# EAGLE design mojo_test_esc (EAGLE 7.6.0)
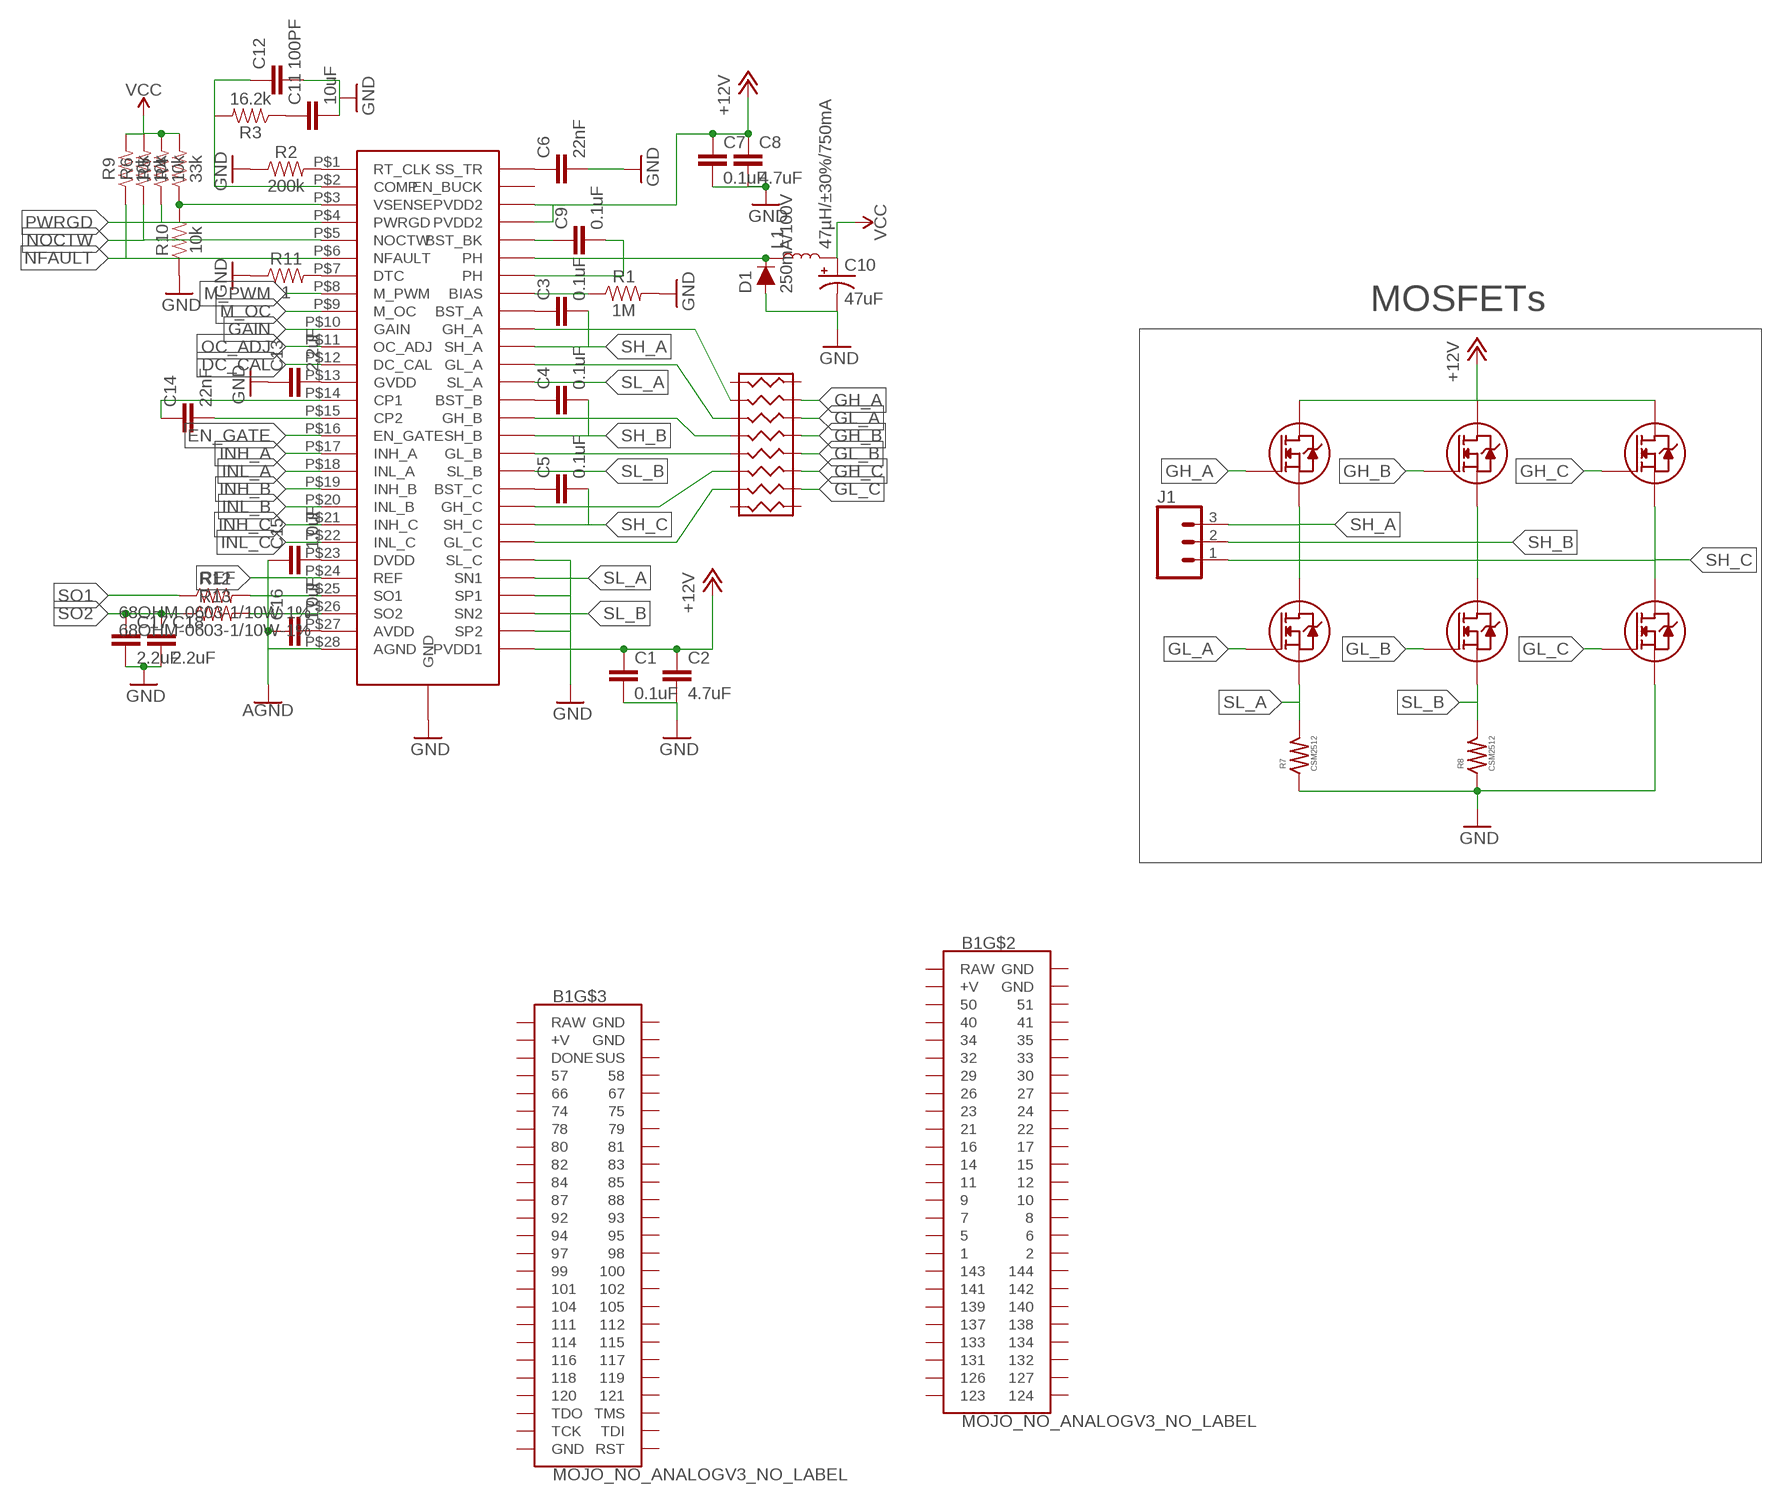
[diagram p0: schematic, sheet 1]

## Parts
B1  MOJO_NO_ANALOGV3_NO_LABEL  [MOJO_V3_NO_LABEL_NO_ANALOG]
C1  0.1uF  0.1UF-0402-16V-10%  [0402]
C2  4.7uF  4.7UF0603  [0603]
C3  0.1uF  0.1UF-0402-16V-10%  [0402]
C4  0.1uF  0.1UF-0402-16V-10%  [0402]
C5  0.1uF  0.1UF-0402-16V-10%  [0402]
C6  22nF  22NF/22,000PF-0603-50V-10%  [0603]
C7  0.1uF  0.1UF-0402-16V-10%  [0402]
C8  4.7uF  4.7UF0603  [0603]
C9  0.1uF  0.1UF-0402-16V-10%  [0402]
C10  47uF  47UF-POLAR-EIA3528-10V-10%  [EIA3528]
C11  10uF  10UF-0603-6.3V-20%  [0603]
C12  100PF  100PF-0402-50V-5%  [0402]
C13  2.2uF  2.2UF-0603-10V-20%  [0603]
C14  22nF  22NF/22,000PF-0603-50V-10%  [0603]
C15  1.0uF  1.0UF-0402-16V-10%  [0402]
C16  1.0uF  1.0UF-0402-16V-10%  [0402]
C17  2.2uF  2.2UF-0603-10V-20%  [0603]
C18  2.2uF  2.2UF-0603-10V-20%  [0603]
D1  250mA/100V  DIODE-BAS16J  [SOD-323]
J1  CONN_03-SCREW-5MM  [SCREWTERMINAL-5MM-3]
L1  47µH/±30%/750mA  INDUCTOR-CR54-47UH  [CR54]
MOSFET_H_A_1  MOSFET  [SOP_ADVANCE]
MOSFET_H_B_1  MOSFET  [SOP_ADVANCE]
MOSFET_H_C_1  MOSFET  [SOP_ADVANCE]
MOSFET_L_A_1  MOSFET  [SOP_ADVANCE]
MOSFET_L_B_1  MOSFET  [SOP_ADVANCE]
MOSFET_L_C_1  MOSFET  [SOP_ADVANCE]
R1  1M  1MOHM-0603-1/4W-5%  [0603]
R2  200k  200KOHM-0603-1/10W-1%  [0603]
R3  16.2k  16.2KOHM-0603-1/10W-1%  [0603]
R4  33k  33KOHM-0603-1/10W-1%  [0603]
R5  10k  10KOHM-0603-1/10W-1%  [0603]
R6  10k  10KOHM-0603-1/10W-1%  [0603]
R7  CSM2512  [CSM2512]
R8  CSM2512  [CSM2512]
R9  10k  10KOHM-0603-1/10W-1%  [0603]
R10  10k  10KOHM-0603-1/10W-1%  [0603]
R11  1  1OHM-0603-1/10W-1%  [0603]
R12  68OHM-0603-1/10W-1%  [0603]
R13  68OHM-0603-1/10W-1%  [0603]
U$1  DRV8302  [DRV8302]
U$2  EXB2HV  [EXB2HV]

## Nets
+12V: C1.1 C2.1 C7.1 C8.1 MOSFET_H_A_1.P$5(D2) MOSFET_H_A_1.P$6(D2) MOSFET_H_A_1.P$7(D2) MOSFET_H_A_1.P$8(D2) MOSFET_H_A_1.P$9(D2) MOSFET_H_B_1.P$5(D2) MOSFET_H_B_1.P$6(D2) MOSFET_H_B_1.P$7(D2) MOSFET_H_B_1.P$8(D2) MOSFET_H_B_1.P$9(D2) MOSFET_H_C_1.P$5(D2) MOSFET_H_C_1.P$6(D2) MOSFET_H_C_1.P$7(D2) MOSFET_H_C_1.P$8(D2) MOSFET_H_C_1.P$9(D2) U$1.P$29(PVDD1) U$1.P$53(PVDD2) U$1.P$54(PVDD2)
AGND: C15.1 C16.1 U$1.P$28(AGND)
DC_CAL: U$1.P$12(DC_CAL)
EN_GATE: U$1.P$16(EN_GATE)
GAIN: U$1.P$10(GAIN)
GH_A: MOSFET_H_A_1.P$4(G1)
GH_B: MOSFET_H_B_1.P$4(G1)
GH_C: MOSFET_H_C_1.P$4(G1)
GL_A: MOSFET_L_A_1.P$4(G1)
GL_A_BEF_RES: U$1.P$45(GL_A) U$2.P3B
GL_B: MOSFET_L_B_1.P$4(G1)
GL_C: MOSFET_L_C_1.P$4(G1)
GND: C1.2 C2.2 C6.2 C7.2 C8.2 C10.C(-) C11.2 C12.2 C13.1 C17.2 C18.2 D1.A MOSFET_L_C_1.P$1(S3) MOSFET_L_C_1.P$2(S3) MOSFET_L_C_1.P$3(S3) R1.2 R2.1 R7.P1L R7.P2L R8.P1L R8.P2L R10.1 R11.1 U$1.GND_PAD2(GND) U$1.GND_PAD3(GND) U$1.GND_PAD(GND) U$1.P$30(SP2) U$1.P$32(SP1) U$1.P$34(SL_C) U$1.VIA1(GND) U$1.VIA2(GND) U$1.VIA3(GND) U$1.VIA4(GND) U$1.VIA5(GND) U$1.VIA6(GND) U$1.VIA7(GND) U$1.VIA8(GND) U$1.VIA9(GND) U$1.VIA10(GND) U$1.VIA11(GND) U$1.VIA12(GND) U$1.VIA13(GND) U$1.VIA14(GND) U$1.VIA15(GND) U$1.VIA16(GND) U$1.VIA17(GND) U$1.VIA18(GND) U$1.VIA19(GND) U$1.VIA20(GND) U$1.VIA21(GND) U$1.VIA22(GND) U$1.VIA23(GND) U$1.VIA24(GND) U$1.VIA25(GND) U$1.VIA26(GND) U$1.VIA27(GND) U$1.VIA28(GND) U$1.VIA29(GND) U$1.VIA30(GND) U$1.VIA31(GND) U$1.VIA32(GND) U$1.VIA33(GND) U$1.VIA34(GND) U$1.VIA35(GND) U$1.VIA36(GND) U$1.VIA37(GND) U$1.VIA38(GND) U$1.VIA39(GND) U$1.VIA40(GND) U$1.VIA41(GND) U$1.VIA42(GND) U$1.VIA43(GND) U$1.VIA44(GND)
INH_A: U$1.P$17(INH_A)
INH_B: U$1.P$19(INH_B)
INH_C: U$1.P$21(INH_C)
INL_A: U$1.P$18(INL_A)
INL_B: U$1.P$20(INL_B)
INL_C: U$1.P$22(INL_C)
M_OC: U$1.P$9(M_OC)
M_PWM: U$1.P$8(M_PWM)
N$1: U$1.P$47(GH_A) U$2.P2B
N$2: C6.1 U$1.P$56(SS_TR)
N$3: U$1.P$42(GH_B) U$2.P4B
N$4: U$1.P$40(GL_B) U$2.P5B
N$5: U$1.P$37(GH_C) U$2.P6B
N$6: U$1.P$35(GL_C) U$2.P7B
N$7: C3.1 U$1.P$48(BST_A)
N$8: C4.1 U$1.P$43(BST_B)
N$9: C5.1 U$1.P$38(BST_C)
N$10: C9.1 U$1.P$52(BST_BK)
N$11: C9.2 D1.C L1.P$1 U$1.P$50(PH) U$1.P$51(PH)
N$12: R2.2 U$1.P$1(RT_CLK)
N$13: R1.1 U$1.P$49(BIAS)
N$14: C12.1 R3.2 U$1.P$2(COMP)
N$15: C11.1 R3.1
N$16: R11.2 U$1.P$7(DTC)
N$17: C13.2 U$1.P$13(GVDD)
N$18: C14.1 U$1.P$14(CP1)
N$19: R4.1 R10.2 U$1.P$3(VSENSE)
N$20: C14.2 U$1.P$15(CP2)
N$21: C15.2 U$1.P$23(DVDD)
N$22: C16.2 U$1.P$27(AVDD)
N$23: R12.2 U$1.P$25(SO1)
N$24: R13.2 U$1.P$26(SO2)
NFAULT: R9.1 U$1.P$6(NFAULT)
NOCTW: R6.1 U$1.P$5(NOCTW)
OC_ADJ: U$1.P$11(OC_ADJ)
PWRGD: R5.1 U$1.P$4(PWRGD)
REF: U$1.P$24(REF)
SH_A: C3.2 J1.3 MOSFET_H_A_1.P$1(S3) MOSFET_H_A_1.P$2(S3) MOSFET_H_A_1.P$3(S3) MOSFET_L_A_1.P$5(D2) MOSFET_L_A_1.P$6(D2) MOSFET_L_A_1.P$7(D2) MOSFET_L_A_1.P$8(D2) MOSFET_L_A_1.P$9(D2) U$1.P$46(SH_A)
SH_B: C4.2 J1.2 MOSFET_H_B_1.P$1(S3) MOSFET_H_B_1.P$2(S3) MOSFET_H_B_1.P$3(S3) MOSFET_L_B_1.P$5(D2) MOSFET_L_B_1.P$6(D2) MOSFET_L_B_1.P$7(D2) MOSFET_L_B_1.P$8(D2) MOSFET_L_B_1.P$9(D2) U$1.P$41(SH_B)
SH_C: C5.2 J1.1 MOSFET_H_C_1.P$1(S3) MOSFET_H_C_1.P$2(S3) MOSFET_H_C_1.P$3(S3) MOSFET_L_C_1.P$5(D2) MOSFET_L_C_1.P$6(D2) MOSFET_L_C_1.P$7(D2) MOSFET_L_C_1.P$8(D2) MOSFET_L_C_1.P$9(D2) U$1.P$36(SH_C)
SL_A: MOSFET_L_A_1.P$1(S3) MOSFET_L_A_1.P$2(S3) MOSFET_L_A_1.P$3(S3) R7.P1R R7.P2R U$1.P$33(SN1) U$1.P$44(SL_A)
SL_B: MOSFET_L_B_1.P$1(S3) MOSFET_L_B_1.P$2(S3) MOSFET_L_B_1.P$3(S3) R8.P1R R8.P2R U$1.P$31(SN2) U$1.P$39(SL_B)
SO1: R12.1
SO2: C17.1 C18.1 R13.1
VCC: C10.A(+) L1.P$2 R4.2 R5.2 R6.2 R9.2
Unconnected: B1.1 B1.2 B1.5 B1.6 B1.7 B1.8 B1.9 B1.10 B1.11 B1.12 B1.14 B1.15 B1.16 B1.17 B1.21 B1.22 B1.23 B1.24 B1.26 B1.27 B1.29 B1.30 B1.32 B1.33 B1.34 B1.35 B1.40 B1.41 B1.50 B1.51 B1.57 B1.58 B1.66 B1.67 B1.74 B1.75 B1.78 B1.79 B1.80 B1.81 B1.82 B1.83 B1.84 B1.85 B1.87 B1.88 B1.92 B1.93 B1.94 B1.95 B1.97 B1.98 B1.99 B1.100 B1.101 B1.102 B1.104 B1.105 B1.111 B1.112 B1.114 B1.115 B1.116 B1.117 B1.118 B1.119 B1.120 B1.121 B1.123 B1.124 B1.126 B1.127 B1.131 B1.132 B1.133 B1.134 B1.137 B1.138 B1.139 B1.140 B1.141 B1.142 B1.143 B1.144 B1.DONE B1.GND@1(GND) B1.GND@2(GND) B1.GND@3(GND) B1.GND@4(GND) B1.GND@6(GND) B1.RAW@1(RAW) B1.RAW@2(RAW) B1.RST B1.SUS B1.TCK B1.TDI B1.TDO B1.TMS B1.V@1(+V) B1.V@2(+V) U$1.P$55(EN_BUCK) U$2.P1 U$2.P1B U$2.P2 U$2.P3 U$2.P4 U$2.P5 U$2.P6 U$2.P7 U$2.P8 U$2.P8B

## Notes on the sheet
- MOSFETs

## Library data of the parts
B1 = mojo_test_esc:MOJO_NO_ANALOG: Mojo v3 FPGA Development Board Mechanical footprint with connectors for Mojo FPGA dev board. SparkFun Products: Mojo v3 <https://www.sparkfun.com/products/11953>
C1 C3-C5 C7 C9 = SparkFun-Capacitors:0.1UF: 0.1µF ceramic capacitors A capacitor is a passive two-terminal electrical component used to store electrical energy temporarily in an electric field.; PROD_ID: CAP-12416
C2 C8 = SparkFun-Capacitors:4.7UF: 4.7µF ceramic capacitors A capacitor is a passive two-terminal electrical component used to store electrical energy temporarily in an electric field.; PROD_ID: CAP-08280
C6 C14 = SparkFun-Capacitors:22NF/22,000PF: 0.022uF/22nF/22,000pF ceramic capacitors A capacitor is a passive two-terminal electrical component used to store electrical energy temporarily in an electric field.; PROD_ID: CAP-07885
C10 = SparkFun-Capacitors:47UF-POLAR: 47µF polarized capacitors A capacitor is a passive two-terminal electrical component used to store electrical energy temporarily in an electric field.; PROD_ID: CAP-08310
C11 = SparkFun-Capacitors:10UF: 10.0µF ceramic capacitors A capacitor is a passive two-terminal electrical component used to store electrical energy temporarily in an electric field.; PROD_ID: CAP-11015
C12 = SparkFun-Capacitors:100PF: 100pF/0.1nF ceramic capacitors A capacitor is a passive two-terminal electrical component used to store electrical energy temporarily in an electric field.; PROD_ID: CAP-13458
C13 C17 C18 = SparkFun-Capacitors:2.2UF: 2.2µF ceramic capacitors A capacitor is a passive two-terminal electrical component used to store electrical energy temporarily in an electric field.; PROD_ID: CAP-07888
C15 C16 = SparkFun-Capacitors:1.0UF: 1µF ceramic capacitors A capacitor is a passive two-terminal electrical component used to store electrical energy temporarily in an electric field.; PROD_ID: CAP-12417
D1 = SparkFun-DiscreteSemi:DIODE: Diode These are standard reverse protection diodes and small signal diodes. SparkFun Products: SparkFun SparkPunk Sound Kit <https://www.sparkfun.com/products/11177> SparkFun ESP8266 Thing <https://www.sparkfun.com/products/13231>; PROD_ID: DIO-09646
J1 = SparkFun-Connectors:CONN_03: Multi connection point. Often used as Generic Header-pin footprint for 0.1 inch spaced/style header connections On any of the 0.1 inch spaced packages, you can populate with these: Break Away Headers - Straight <https://www.sparkfun.com/products/116> (PRT-00116) Break Away Male Headers - Right Angle <https://www.sparkfun.com/products/553> (PRT-00553) Female Headers <https://www.sparkfun.com/products/115> (PRT-00115) Break Away Headers - Machine Pin <https://www.sparkfun.com/products/117> (PRT-00117) Break Away Female Headers - Swiss Machine Pin <https://www.sparkfun.com/products/743> (PRT-00743) Stackable Header - 3 Pin (Female, 0.1") <https://www.sparkfun.com/products/13875> (PRT-13875) For SCREWTERMINALS and SPRING TERMINALS visit here: Screw Terimnals on SparkFun.com <https://www.sparkfun.com/search/results?term=Screw+Terminals> (5mm/3.5mm/2.54mm spacing) This device is also useful as a general connection point to wire up your design to another part of your project. Our various solder wires solder well into these plated through hole pads. Hook-Up Wire - Assortment (Stranded, 22 AWG) <https://www.sparkfun.com/products/11375> (PRT-11375) Hook-Up Wire - Assortment (Solid Core, 22 AWG) <https://www.sparkfun.com/products/11367> (PRT-11367) View the entire wire category on our website here <https://www.sparkfun.com/categories/141> Special notes: Molex polarized connector foot print use with SKU : PRT-08232 with associated crimp pins and housings.; PROD_ID: CONN-10134; SF_SKU: PRT-08433
L1 = SparkFun-Coils:INDUCTOR: Inductors Resist changes in electrical current. Basically a coil of wire. SparkFun Products: SparkFun Load Cell Amplifier - HX711 <https://www.sparkfun.com/products/13879> IOIO-OTG - V2.2 <https://www.sparkfun.com/products/13613>; PROD_ID: NDUC-10789
MOSFET_H_A_1 MOSFET_H_B_1 MOSFET_H_C_1 MOSFET_L_A_1 MOSFET_L_B_1 MOSFET_L_C_1 = mojo_test_esc:MOSFET
R1 = SparkFun-Resistors:1MOHM: 1MΩ resistor A resistor is a passive two-terminal electrical component that implements electrical resistance as a circuit element. Resistors act to reduce current flow, and, at the same time, act to lower voltage levels within circuits. - Wikipedia; PROD_ID: RES-07868
R2 = SparkFun-Resistors:200KOHM: 200kΩ resistor A resistor is a passive two-terminal electrical component that implements electrical resistance as a circuit element. Resistors act to reduce current flow, and, at the same time, act to lower voltage levels within circuits. - Wikipedia; PROD_ID: RES-09385
R3 = SparkFun-Resistors:16.2KOHM: 16.2kΩ resistor A resistor is a passive two-terminal electrical component that implements electrical resistance as a circuit element. Resistors act to reduce current flow, and, at the same time, act to lower voltage levels within circuits. - Wikipedia; PROD_ID: RES-12187
R4 = SparkFun-Resistors:33KOHM: 33kΩ resistor A resistor is a passive two-terminal electrical component that implements electrical resistance as a circuit element. Resistors act to reduce current flow, and, at the same time, act to lower voltage levels within circuits. - Wikipedia; PROD_ID: RES-08416
R5 R6 R9 R10 = SparkFun-Resistors:10KOHM: 10kΩ resistor A resistor is a passive two-terminal electrical component that implements electrical resistance as a circuit element. Resistors act to reduce current flow, and, at the same time, act to lower voltage levels within circuits. - Wikipedia; PROD_ID: RES-00824
R7 R8 = mojo_test_esc:CSM2512
R11 = SparkFun-Resistors:1OHM: 1Ω resistor A resistor is a passive two-terminal electrical component that implements electrical resistance as a circuit element. Resistors act to reduce current flow, and, at the same time, act to lower voltage levels within circuits. - Wikipedia; PROD_ID: RES-08269
R12 R13 = SparkFun-Resistors:68OHM: 68Ω resistor A resistor is a passive two-terminal electrical component that implements electrical resistance as a circuit element. Resistors act to reduce current flow, and, at the same time, act to lower voltage levels within circuits. - Wikipedia
U$1 = mojo_test_esc:DRV8302
U$2 = mojo_test_esc:EXB2HV

## Board
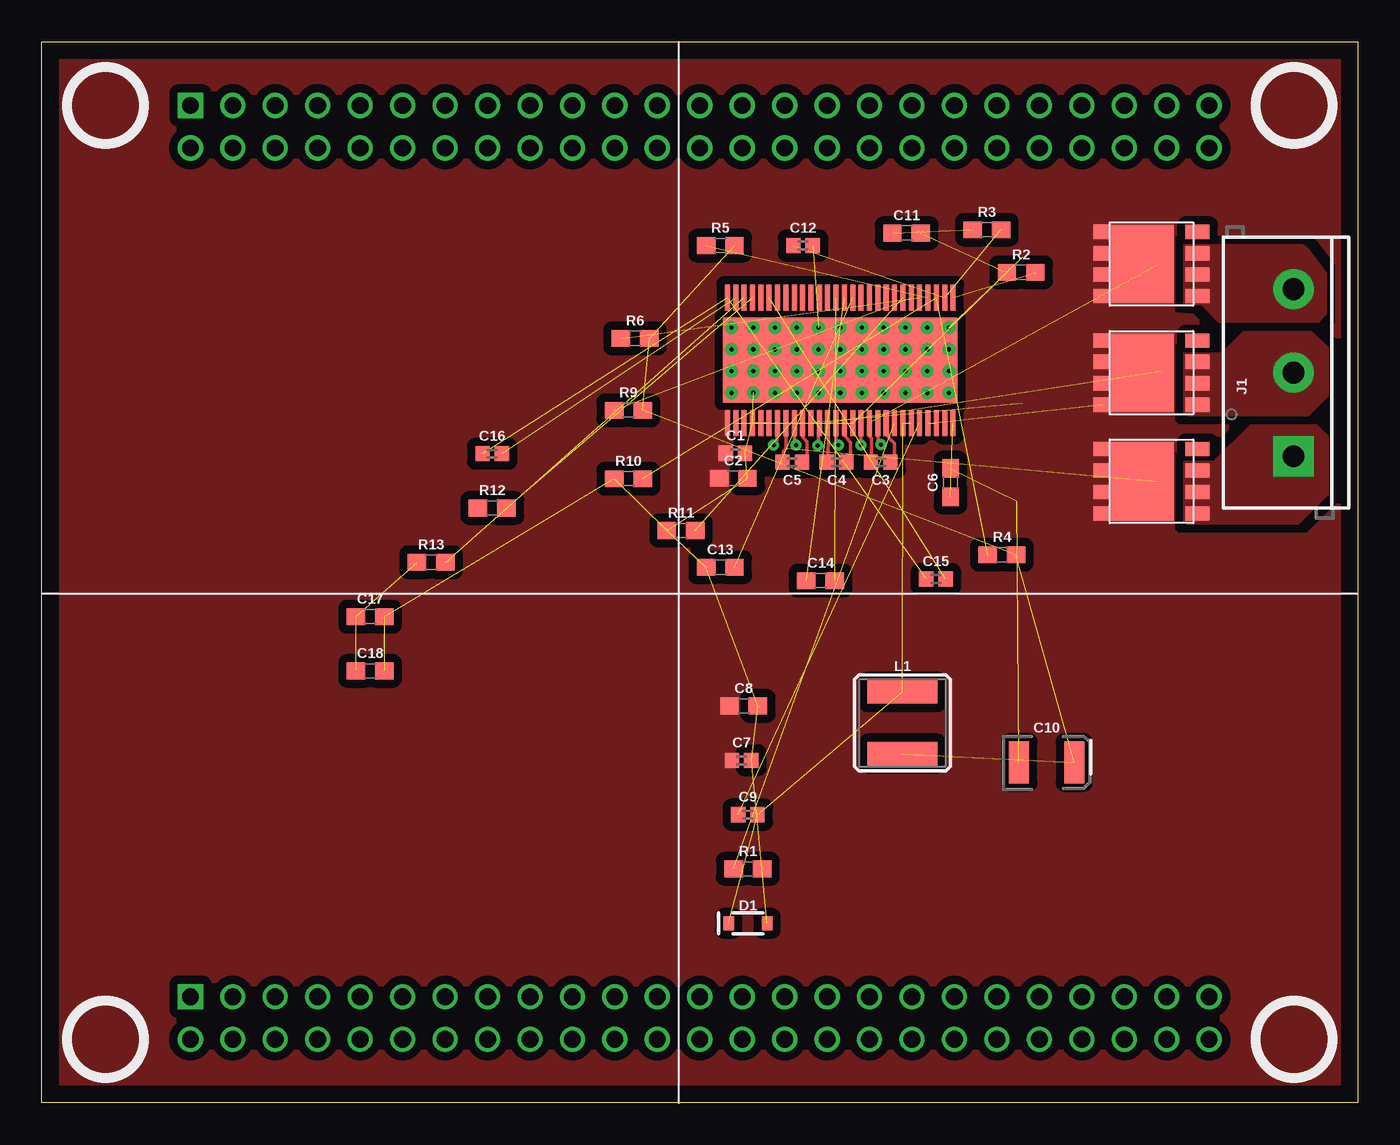
[diagram p1: board, top side]
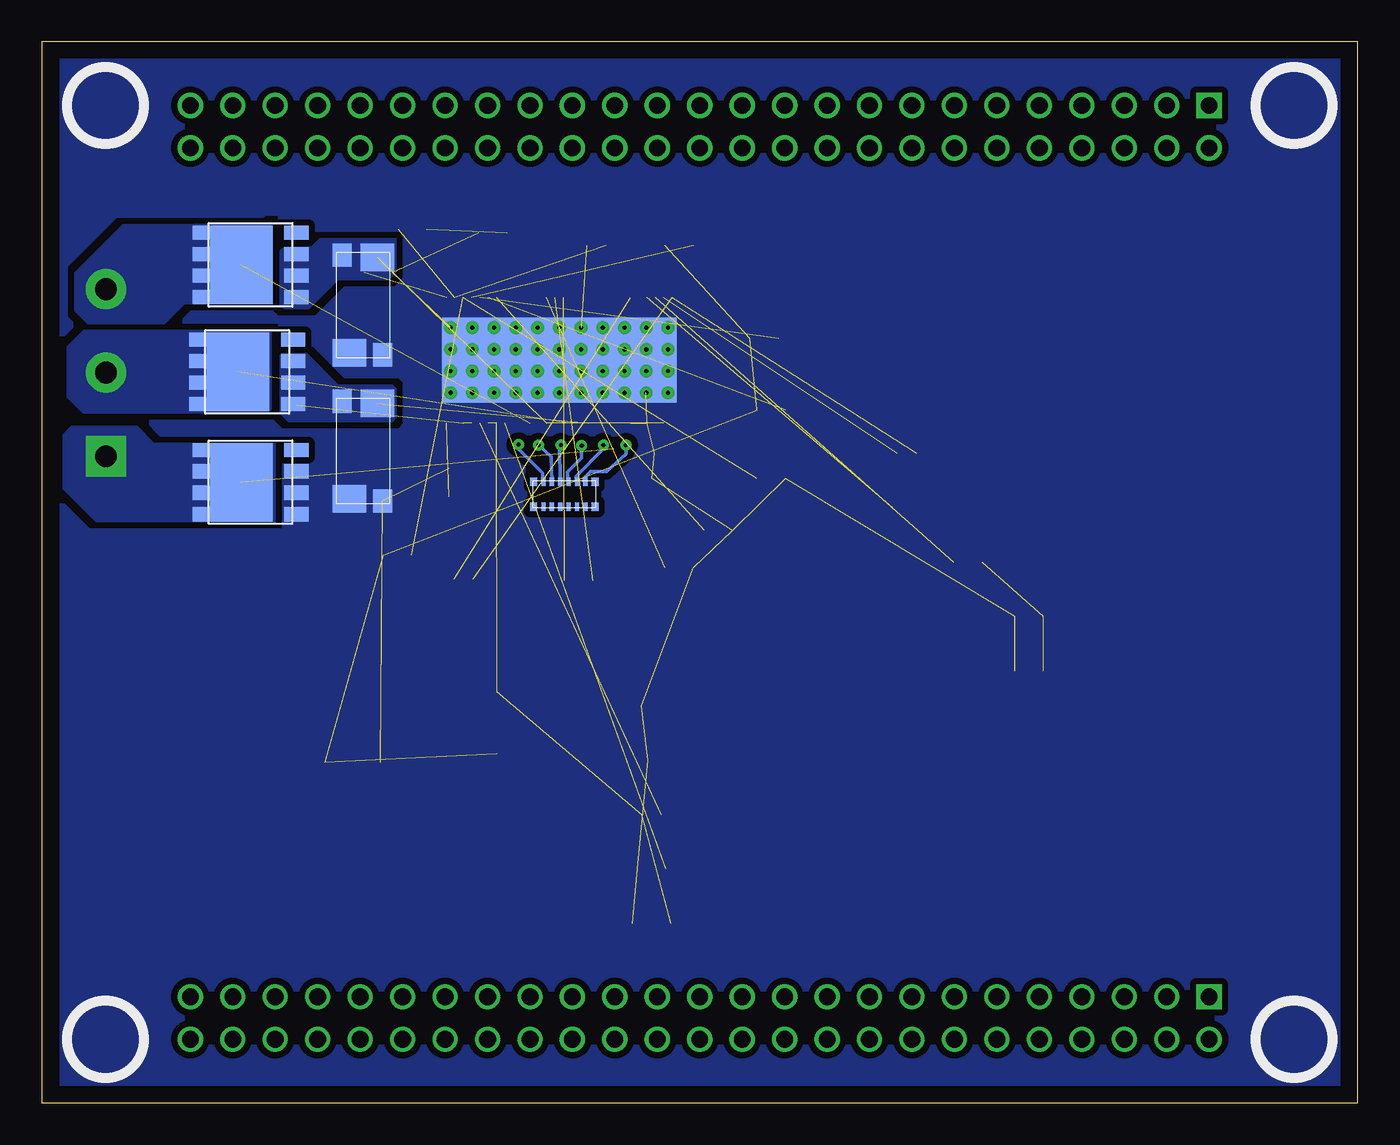
[diagram p2: board, bottom side, seen from below]

Size 78.74 x 63.5 mm. Coordinates in mm from the lower left corner, seen from the top.
Outline: 0,63.5 78.74,63.5 78.74,0 0,0 0,63.5
Copper layers (1*16): Top 0.035mm / dielectric 1.5mm / Bottom 0.035mm
Design rules "default": minimum track width 10mil, minimum drill 24mil, track to track 8mil, track to pad 8mil, pad to pad 8mil, via to via 8mil, smd to smd 8mil, copper to edge 40mil, drill to drill 8mil, minimum pad ring 10mil, minimum via ring 8mil, stop-mask expansion 4mil, vias tented up to drill 0mil, thermal gap 10mil

### Footprints (pad centres in the part's own frame; a part is rotated, then mirrored left to right if it is on the bottom)
MOJO_V3_NO_LABEL_NO_ANALOG = drill 1: 1 11.43,26.67; 2 11.43,29.21; 5 8.89,26.67; 6 8.89,29.21; 7 6.35,26.67; 8 6.35,29.21; 9 3.81,26.67; 10 3.81,29.21; 11 1.27,26.67; 12 1.27,29.21; 14 -1.27,26.67; 15 -1.27,29.21; 16 -3.81,26.67; 17 -3.81,29.21; 21 -6.35,26.67; 22 -6.35,29.21; 23 -8.89,26.67; 24 -8.89,29.21; 26 -11.43,26.67; 27 -11.43,29.21; 29 -13.97,26.67; 30 -13.97,29.21; 32 -16.51,26.67; 33 -16.51,29.21; 34 -19.05,26.67; 35 -19.05,29.21; 40 -21.59,26.67; 41 -21.59,29.21; 50 -24.13,26.67; 51 -24.13,29.21; 57 -21.59,-26.67; 58 -21.59,-24.13; 66 -19.05,-26.67; 67 -19.05,-24.13; 74 -16.51,-26.67; 75 -16.51,-24.13; 78 -13.97,-26.67; 79 -13.97,-24.13; 80 -11.43,-26.67; 81 -11.43,-24.13; 82 -8.89,-26.67; 83 -8.89,-24.13; 84 -6.35,-26.67; 85 -6.35,-24.13; 87 -3.81,-26.67; 88 -3.81,-24.13; 92 -1.27,-26.67; 93 -1.27,-24.13; 94 1.27,-26.67; 95 1.27,-24.13; 97 3.81,-26.67; 98 3.81,-24.13; 99 6.35,-26.67; 100 6.35,-24.13; 101 8.89,-26.67; 102 8.89,-24.13; 104 11.43,-26.67; 105 11.43,-24.13; 111 13.97,-26.67; 112 13.97,-24.13; 114 16.51,-26.67; 115 16.51,-24.13; 116 19.05,-26.67; 117 19.05,-24.13; 118 21.59,-26.67; 119 21.59,-24.13; 120 24.13,-26.67; 121 24.13,-24.13; 123 31.75,26.67; 124 31.75,29.21; 126 29.21,26.67; 127 29.21,29.21; 131 26.67,26.67; 132 26.67,29.21; 133 24.13,26.67; 134 24.13,29.21; 137 21.59,26.67; 138 21.59,29.21; 139 19.05,26.67; 140 19.05,29.21; 141 16.51,26.67; 142 16.51,29.21; 143 13.97,26.67; 144 13.97,29.21; DONE -24.13,-26.67; GND@2 -26.67,29.21; GND@4 -26.67,-24.13; GND@6 31.75,-26.67; RAW@1 -29.21,26.67; RAW@2 -29.21,-26.67; RST 31.75,-24.13; SUS -24.13,-24.13; TCK 29.21,-26.67; TDI 29.21,-24.13; TDO 26.67,-26.67; TMS 26.67,-24.13; V@1 -26.67,26.67; V@2 -26.67,-26.67 | drill 1 square: GND@1 -29.21,29.21; GND@3 -29.21,-24.13
0402 = smd 0.85 x 0.9: 1 -0.58,0; 2 0.58,0
0603 = smd 1.1 x 1: 1 -0.85,0; 2 0.85,0
EIA3528 = smd 1.2 x 2.5: A 1.65,0; C -1.65,0
SOD-323 = smd 0.63 x 0.83: A 1.15,0; C -1.15,0
SCREWTERMINAL-5MM-3 = drill 1.3 pad 2.413 square: 1 0,0 | drill 1.3 pad 2.413: 2 5,0; 3 10,0
CR54 = smd 4.2 x 1.4: P$1 0,1.85; P$2 0,-1.85
SOP_ADVANCE = smd 0.85 x 1.45: P$1 -1.925,-2.75; P$2 -0.642,-2.75; P$3 0.642,-2.75; P$4 1.925,-2.75 | smd 4.7 x 3.75: P$5 0,0.55 | smd 0.85 x 1.05: P$6 -1.925,2.95; P$7 -0.642,2.95; P$8 0.642,2.95; P$9 1.925,2.95
CSM2512 = smd 1.397 x 1.143: P1L -2.985,-1.143; P2R 2.985,1.27 | smd 1.651 x 2.007: P1R 2.857,-0.838; P2L -2.857,0.838
DRV8302 = smd 6.35 x 3.61: GND_PAD 0,0 | smd 14 x 5.1: GND_PAD2 0,0 | smd 14 x 5.1 bottom: GND_PAD3 0,0 | smd 0.3 x 1.55: P$1 -6.75,-3.75; P$2 -6.25,-3.75; P$3 -5.75,-3.75; P$4 -5.25,-3.75; P$5 -4.75,-3.75; P$6 -4.25,-3.75; P$7 -3.75,-3.75; P$8 -3.25,-3.75; P$9 -2.75,-3.75; P$10 -2.25,-3.75; P$11 -1.75,-3.75; P$12 -1.25,-3.75; P$13 -0.75,-3.75; P$14 -0.25,-3.75; P$15 0.25,-3.75; P$16 0.75,-3.75; P$17 1.25,-3.75; P$18 1.75,-3.75; P$19 2.25,-3.75; P$20 2.75,-3.75; P$21 3.25,-3.75; P$22 3.75,-3.75; P$23 4.25,-3.75; P$24 4.75,-3.75; P$25 5.25,-3.75; P$26 5.75,-3.75; P$27 6.25,-3.75; P$28 6.75,-3.75; P$29 6.75,3.75; P$30 6.25,3.75; P$31 5.75,3.75; P$32 5.25,3.75; P$33 4.75,3.75; P$34 4.25,3.75; P$35 3.75,3.75; P$36 3.25,3.75; P$37 2.75,3.75; P$38 2.25,3.75; P$39 1.75,3.75; P$40 1.25,3.75; P$41 0.75,3.75; P$42 0.25,3.75; P$43 -0.25,3.75; P$44 -0.75,3.75; P$45 -1.25,3.75; P$46 -1.75,3.75; P$47 -2.25,3.75; P$48 -2.75,3.75; P$49 -3.25,3.75; P$50 -3.75,3.75; P$51 -4.25,3.75; P$52 -4.75,3.75; P$53 -5.25,3.75; P$54 -5.75,3.75; P$55 -6.25,3.75; P$56 -6.75,3.75 | drill 0.254 pad 0.381: VIA1 -6.5,-1.95; VIA2 -6.5,-0.65; VIA3 -6.5,0.65; VIA4 -6.5,1.95; VIA5 -5.2,-1.95; VIA6 -5.2,-0.65; VIA7 -5.2,0.65; VIA8 -5.2,1.95; VIA9 -3.9,-1.95; VIA10 -3.9,-0.65; VIA11 -3.9,0.65; VIA12 -3.9,1.95; VIA13 -2.6,-1.95; VIA14 -2.6,-0.65; VIA15 -2.6,0.65; VIA16 -2.6,1.95; VIA17 -1.3,-1.95; VIA18 -1.3,-0.65; VIA19 -1.3,0.65; VIA20 -1.3,1.95; VIA21 0,-1.95; VIA22 0,-0.65; VIA23 0,0.65; VIA24 0,1.95; VIA25 1.3,-1.95; VIA26 1.3,-0.65; VIA27 1.3,0.65; VIA28 1.3,1.95; VIA29 2.6,-1.95; VIA30 2.6,-0.65; VIA31 2.6,0.65; VIA32 2.6,1.95; VIA33 3.9,-1.95; VIA34 3.9,-0.65; VIA35 3.9,0.65; VIA36 3.9,1.95; VIA37 5.2,-1.95; VIA38 5.2,-0.65; VIA39 5.2,0.65; VIA40 5.2,1.95; VIA41 6.5,-1.95; VIA42 6.5,-0.65; VIA43 6.5,0.65; VIA44 6.5,1.95
EXB2HV = smd 0.425 x 0.5: P1 -1.837,-0.75; P1B -1.837,0.75; P8 1.837,-0.75; P8B 1.837,0.75 | smd 0.25 x 0.5: P2 -1.25,-0.75; P2B -1.25,0.75; P3 -0.75,-0.75; P3B -0.75,0.75; P4 -0.25,-0.75; P4B -0.25,0.75; P5 0.25,-0.75; P5B 0.25,0.75; P6 0.75,-0.75; P6B 0.75,0.75; P7 1.25,-0.75; P7B 1.25,0.75

### Placement (x,y rotation side)
B1  38.1,30.48 0 top
C1  41.5,38.88 0 top
C2  41.38,37.38 0 top
C3  50.2,38.35 180 top
C4  47.55,38.35 180 top
C5  44.9,38.35 180 top
C6  54.38,37.12 90 top
C7  41.88,20.5 0 top
C8  42,23.75 0 top
C9  42.25,17.25 0 top
C10  60.12,20.38 0 top
C11  51.75,52.05 0 top
C12  45.55,51.3 0 top
C13  40.6,32.05 0 top
C14  46.6,31.25 0 top
C15  53.5,31.35 0 top
C16  26.95,38.85 0 top
C17  19.65,29.1 0 top
C18  19.65,25.85 0 top
D1  42.25,10.75 0 top
J1  74.9,38.7 90 top
L1  51.5,22.75 0 top
MOSFET_H_A_1  66.4,50.2 90 top
MOSFET_H_B_1  66.4,43.7 90 top
MOSFET_H_C_1  66.4,37.2 90 top
MOSFET_L_A_1  66.25,50.15 90 bottom
MOSFET_L_B_1  66.45,43.75 90 bottom
MOSFET_L_C_1  66.25,37.15 90 bottom
R1  42.25,14 0 top
R2  58.6,49.7 0 top
R3  56.55,52.25 0 top
R4  57.45,32.8 0 top
R5  40.6,51.3 0 top
R6  35.5,45.75 0 top
R7  59.5,47.75 90 bottom
R8  59.5,39 90 bottom
R9  35.1,41.45 0 top
R10  35.1,37.35 0 top
R11  38.25,34.25 0 top
R12  26.95,35.6 0 top
R13  23.3,32.35 0 top
U$1  47.77,44.45 180 top
U$2  47.47,36.42 0 bottom

### Tracks (layer width: path | path; a pad name or v marks a point on that pad's centre or on a via)
+12V  (2 unrouted)
  pour Top (isolate 0.508, rank 6, no thermals): 1,1 78,1 78,63 1,63
  pour Top (no thermals): 41.2,41.45 40.45,41.45 40.45,38.4 41.35,38.4 41.35,39.75 41.2,39.75
AGND  (2 unrouted)
GL_A_BEF_RES  (via drill 0.25 pad 0.51)
  Top 0.203: U$1.P$45 v49.02,39.37
  Bottom 0.203: v49.02,39.37 48.27,38.67 U$2.P3B
GND  (20 unrouted)
  pour Bottom (isolate 0.381, rank 6, no thermals): 1,1 78,1 78,62 78,63 1,63
N$1  (via drill 0.25 pad 0.51)
  Top 0.203: U$1.P$47 50.02,39.59 v50.22,39.4
  Bottom 0.203: v50.22,39.4 50.22,39.14 48.77,37.69 48.77,37.17 U$2.P2B
N$2  (1 unrouted)
N$3  (via drill 0.25 pad 0.51)
  Top 0.203: U$1.P$42 47.52,39.55 v47.68,39.37
  Bottom 0.203: v47.68,39.37 47.77,39.3 U$2.P4B
N$4  (via drill 0.25 pad 0.51)
  Top 0.203: U$1.P$40 46.47,39.66 v46.43,39.34
  Bottom 0.203: v46.43,39.34 46.43,38.58 47.27,37.74 47.27,37.17 U$2.P5B
N$5  (via drill 0.25 pad 0.51)
  Top 0.203: U$1.P$37 45.02,39.58 v45.14,39.37
  Bottom 0.203: v45.14,39.37 45.14,39.17 46.76,37.49 46.76,37.17 U$2.P6B
N$6  (via drill 0.25 pad 0.51)
  Top 0.203: U$1.P$35 44,39.66 v43.79,39.37
  Bottom 0.203: v43.79,39.37 43.79,38.84 44.96,37.77 45.9,37.77 46.28,37.39 46.28,37.17 U$2.P7B
N$7
  Top 0.203: U$1.P$48 50.55,39.98 51.01,39.47 51.01,38.45 C3.1
N$8
  Top 0.203: U$1.P$43 48.08,39.88 48.38,39.5 48.38,38.4 C4.1
N$9
  Top 0.203: U$1.P$38 45.54,39.98 45.54,39.83 45.8,39.57 45.8,38.32 C5.1
N$10  (1 unrouted)
N$11  (4 unrouted)
N$12  (1 unrouted)
N$13  (1 unrouted)
N$14  (2 unrouted)
N$15  (1 unrouted)
N$16  (1 unrouted)
N$17  (1 unrouted)
N$18  (1 unrouted)
N$19  (2 unrouted)
N$20  (1 unrouted)
N$21  (1 unrouted)
N$22  (1 unrouted)
N$23  (1 unrouted)
N$24  (1 unrouted)
NFAULT  (1 unrouted)
NOCTW  (1 unrouted)
PWRGD  (1 unrouted)
SH_A  (1 unrouted)
  Top 0.203: U$1.P$46 49.55,39.86 49.66,39.75 49.65,38.42 C3.2
  pour Top (no thermals): 68.3,51.4 75.36,51.4 arc-45 75.83,51.07 76.9,49.7 76.9,47.24 arc-45 76.87,47.17 76.4,46.7 70.44,46.7 arc-45 70.37,46.73 69.4,47.7 68.3,47.8
  pour Bottom (no thermals): 65.1,52.6 73.9,52.6 76.8,49.7 76.8,47.4 76,46.6 71.4,46.6 70.2,47.8 65,47.8 65,52.7
SH_B  (1 unrouted)
  Top 0.203: U$1.P$41 47.02,40.22 47.07,40.16 47.05,38.35 C4.2
  pour Top (no thermals): 68.3,44.9 70.6,44.9 71.9,46.2 76,46.2 77,45.2 77,42.3 75.8,41.1 68.5,41.1 68.3,41.3
  pour Bottom (no thermals): 65,46.25 76.25,46.25 77.25,45.25 77.25,42.25 76.5,41.5 76.25,41.25 65.25,41.25 65,41.5
SH_C  (1 unrouted)
  Top 0.203: U$1.P$36 44.53,39.17 44.37,39.01 44.37,38.52 C5.2
  pour Top (no thermals): 68.3,38.4 70.1,38.4 72.3,40.6 76.3,40.6 77,39.9 77,36.4 75.2,34.6 68.5,34.6 68.3,34.8
  pour Bottom (no thermals): 64.75,39.5 72,39.5 73,40.5 77,40.5 77.5,40 77.5,36.75 75.5,34.75 64.75,34.75
SL_A  (2 unrouted)
  pour Bottom (no thermals): 57.5,51.75 62.12,51.75 62.62,51.25 64.25,51.25 64.5,51 64.5,47.75 64.25,47.5 62.75,47.5 61,49.25 58,49.25 57.5,49.75
SL_B  (2 unrouted)
  pour Bottom (no thermals): 57.5,41 57.75,40.75 64,40.75 64.5,41.25 64.5,44.75 64.38,44.88 62.88,44.88 61,43 57.75,43 57.5,42.75
SO2  (2 unrouted)
VCC  (5 unrouted)

### Text on the board
tFinish: A | B | C